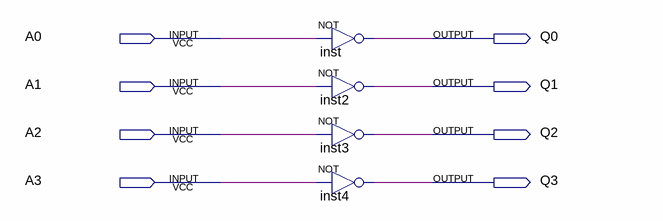
[diagram p0: schematic sheet]
// Quartus schematic 5_not_4_bits.bdf as structural Verilog: 4 symbols, 8 pins
module \5_not_4_bits  (
  input  A0,
  input  A1,
  input  A2,
  input  A3,
  output Q0,
  output Q1,
  output Q2,
  output Q3
);

  not inst (Q0, A0);
  not inst2 (Q1, A1);
  not inst3 (Q2, A2);
  not inst4 (Q3, A3);
endmodule
